# EAGLE design ATX Breakout (EAGLE 6.2)
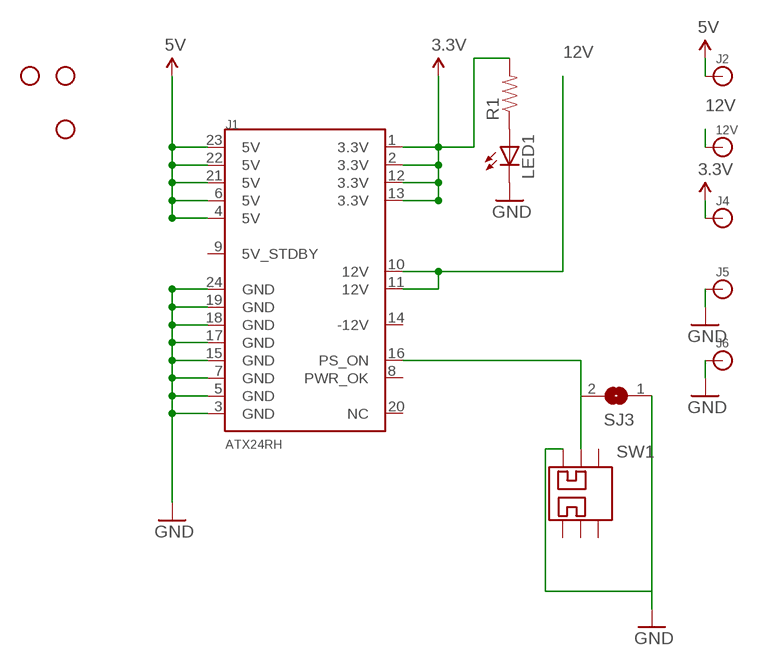
[diagram p0: schematic, sheet 1]

## Parts
12V  BANANA_CONN  [BANANA_CONN]
J1  ATX24RH  [ATX24_RIGHT_ANGLE]
J2  BANANA_CONN  [BANANA_CONN]
J4  BANANA_CONN  [BANANA_CONN]
J5  BANANA_CONN  [BANANA_CONN]
J6  BANANA_CONN  [BANANA_CONN]
JP1  STAND-OFF  [STAND-OFF]
JP2  STAND-OFF  [STAND-OFF]
JP3  STAND-OFF  [STAND-OFF]
LED1  LED0805  [LED-0805]
R1  RESISTOR0805-RES  [0805]
SJ3  SJ  [SJ]
SW1  SLIDE_SWITCH_DPDTRA  [EG2219]

## Nets
3.3V: J1.1(3.3V) J1.2(3.3V) J1.12(3.3V) J1.13(3.3V) J4.P$1 R1.2
5V: J1.4(5V) J1.6(5V) J1.21(5V) J1.22(5V) J1.23(5V) J2.P$1
12V: 12V.P$1 J1.10(12V) J1.11(12V)
GND: J1.3(GND) J1.5(GND) J1.7(GND) J1.15(GND) J1.17(GND) J1.18(GND) J1.19(GND) J1.24(GND) J5.P$1 J6.P$1 LED1.2(C) SJ3.1 SW1.P$1
N$1: LED1.1(A) R1.1
N$3: J1.16(PS_ON) SJ3.2 SW1.P$2
Unconnected: J1.8(PWR_OK) J1.9(5V_STDBY) J1.14(-12V) J1.20(NC) SW1.P$3 SW1.P$4 SW1.P$5 SW1.P$6

## Library data of the parts
12V J2 J4-J6 = SparkFun-Connectors:BANANA_CONN: Through-hole banana jack
J1 = SparkFun-Connectors:ATX24: ATX24 Pin Power Supply Connector This is a good connector for connecting a computer power supply to a PCB. It's massive, but provides many amps of power at 5V and 12V. SKU: PRT-09498
JP1-JP3 = SparkFun-Electromechanical:STAND-OFF: #4 Stand Off This is the mechanical footprint for a #4 phillips button head screw. Use the keepout ring to avoid running the screw head into surrounding components. SKU : PRT-00447
LED1 = ASL:LED: LEDs Standard schematic elements and footprints for 5mm, 3mm, 1206, and 0603 sized LEDs. 5mm - Spark Fun Electronics SKU : COM-00529 (and others)
R1 = ASL:RESISTOR: Resistor Basic schematic elements and footprints for 0603, 1206, and PTH resistors.
SJ3 = New Stuff:SJ: SMD solder JUMPER
SW1 = ASL:SLIDE_SWITCH_DPDT

## Board
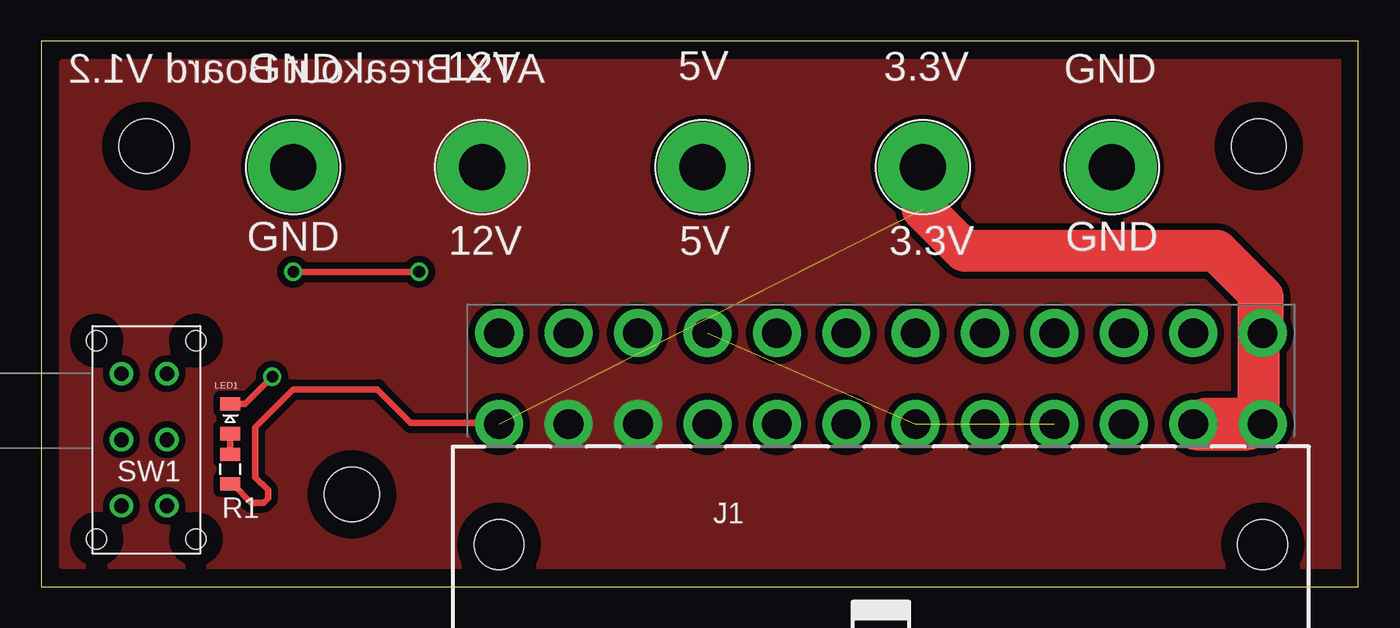
[diagram p1: board, top side]
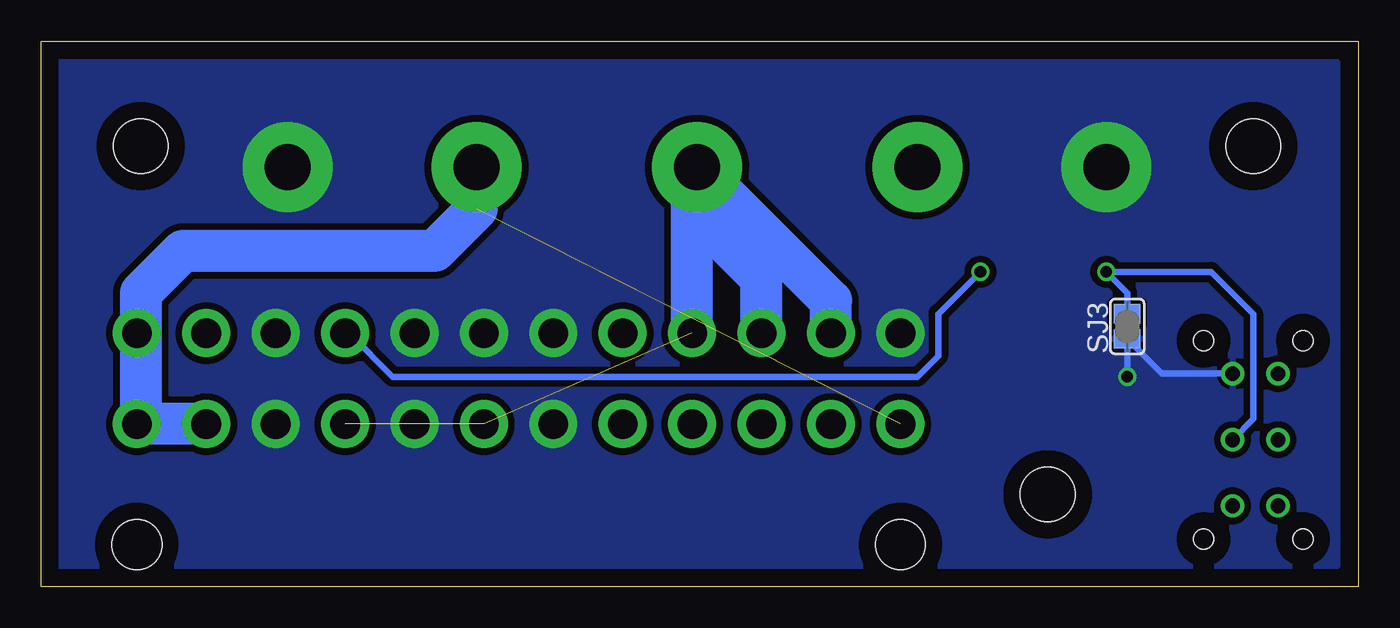
[diagram p2: board, bottom side, seen from below]

Size 79.68 x 33.01 mm. Coordinates in mm from the lower left corner, seen from the top.
Outline: 0,0 79.68,0 79.68,33.01 0,33.01 0,0
Copper layers (1*16): Top 0.035mm / dielectric 1.5mm / Bottom 0.035mm
Design rules: minimum track width 10mil, minimum drill 24mil, track to track 8mil, track to pad 8mil, pad to pad 8mil, via to via 8mil, smd to smd 8mil, copper to edge 40mil, drill to drill 8mil, minimum pad ring 10mil, minimum via ring 8mil, stop-mask expansion 4mil, vias tented up to drill 0mil, thermal gap 10mil

### Footprints (pad centres in the part's own frame; a part is rotated, then mirrored left to right if it is on the bottom)
BANANA_CONN = drill 2.8 pad 5.461: P$1 0,0
ATX24_RIGHT_ANGLE = drill 1.8 pad 2.9: 1 23.1,4.76; 2 18.9,4.76; 3 14.7,4.76; 4 10.5,4.76; 5 6.3,4.76; 6 2.1,4.76; 7 -2.1,4.76; 8 -6.3,4.76; 9 -10.5,4.76; 10 -14.7,4.76; 11 -18.9,4.76; 12 -23.1,4.76; 13 23.1,10.26; 14 18.9,10.26; 15 14.7,10.26; 16 10.5,10.26; 17 6.3,10.26; 18 2.1,10.26; 19 -2.1,10.26; 20 -6.3,10.26; 21 -10.5,10.26; 22 -14.7,10.26; 23 -18.9,10.26; 24 -23.1,10.26 | hole 3: -23.1,-2.54; 23.1,-2.54
STAND-OFF = hole 3.302: 0,0
LED-0805 = smd 0.8 x 1.2: 1 -0.9,0; 2 0.9,0
0805 = smd 0.8 x 1.2: 1 -0.9,0; 2 0.9,0
SJ = smd 1.168 x 1.6: 1 -0.762,0; 2 0.762,0
EG2219 = drill 0.9: P$1 -4,1.25; P$2 0,1.25; P$3 4,1.25; P$4 -4,-1.5; P$5 0,-1.5; P$6 4,-1.5 | hole 1.2: -6,3; -6,-3; 6,3; 6,-3

### Placement (x,y rotation side)
12V  26.67,25.4 0 top
J1  50.8,5.08 0 top
J2  40.01,25.4 0 top
J4  53.34,25.4 0 top
J5  64.77,25.4 0 top
J6  15.24,25.4 0 top
JP1  73.66,26.67 0 top
JP2  6.35,26.67 0 top
JP3  18.8,5.59 0 top
LED1  11.43,10.16 90 top
R1  11.43,7.11 270 top
SJ3  13.97,15.75 90 bottom
SW1  6.35,8.89 270 top

### Tracks (layer width: path | path; a pad name or v marks a point on that pad's centre or on a via)
3.3V  (1 unrouted)
  Top 0.406: R1.2 11.57,6.21 12.7,5.08 13.46,5.08 13.72,5.33 13.72,5.84 12.95,6.6 12.95,9.65 15.24,11.94 20.32,11.94 22.35,9.91 27.63,9.91 J1.12
  Top 2.54: J1.13 73.9,17.54 73.66,17.78 | 73.66,17.78 71.12,20.32 55.88,20.32 53.34,22.86 J4.P$1 | 73.66,10.16 70.49,10.16 69.85,9.53 73.03,9.53 73.66,10.16 | 73.66,10.16 73.66,17.78
  Bottom 2.54: J4.P$1 53.34,22.86 55.88,20.32 71.12,20.32 73.66,17.78 73.66,10.08 J1.1 J1.2
5V  (2 unrouted)
  Bottom 2.54: J1.23 31.9,17.3 J2.P$1 40.3,25.11 40.3,22.86 | J1.21 40.3,22.86 | J1.22 36.1,18.66 40.3,22.86
12V
  pour Top (isolate 0.406): 1.27,31.75 78.74,31.75 78.74,1.27 1.27,1.27
GND  (via drill 0.7)
  Top 0.406: LED1.2 12.33,11.06 v13.97,12.7
  Bottom 0.406: v13.97,12.7 SJ3.1 11.87,12.89 SW1.P$1
  pour Bottom (isolate 0.406): 1.27,31.75 78.74,31.75 78.74,1.27 1.27,1.27
N$1
  Top 0.406: R1.1 LED1.1
N$3  (via drill 0.7)
  Top 0.406: v15.24,19.05 v22.86,19.05
  Bottom 0.406: v22.86,19.05 25.4,16.51 25.4,13.97 26.67,12.7 58.42,12.7 61.06,15.34 J1.16 | SW1.P$2 6.35,10.14 6.35,16.51 8.89,19.05 v15.24,19.05 13.97,17.78 SJ3.2

### Text on the board
tNames: GND | 12V | 5V | 3.3V | ATX Breakout Board V1.2 | GND | GND | 12V | 5V | 3.3V | GND